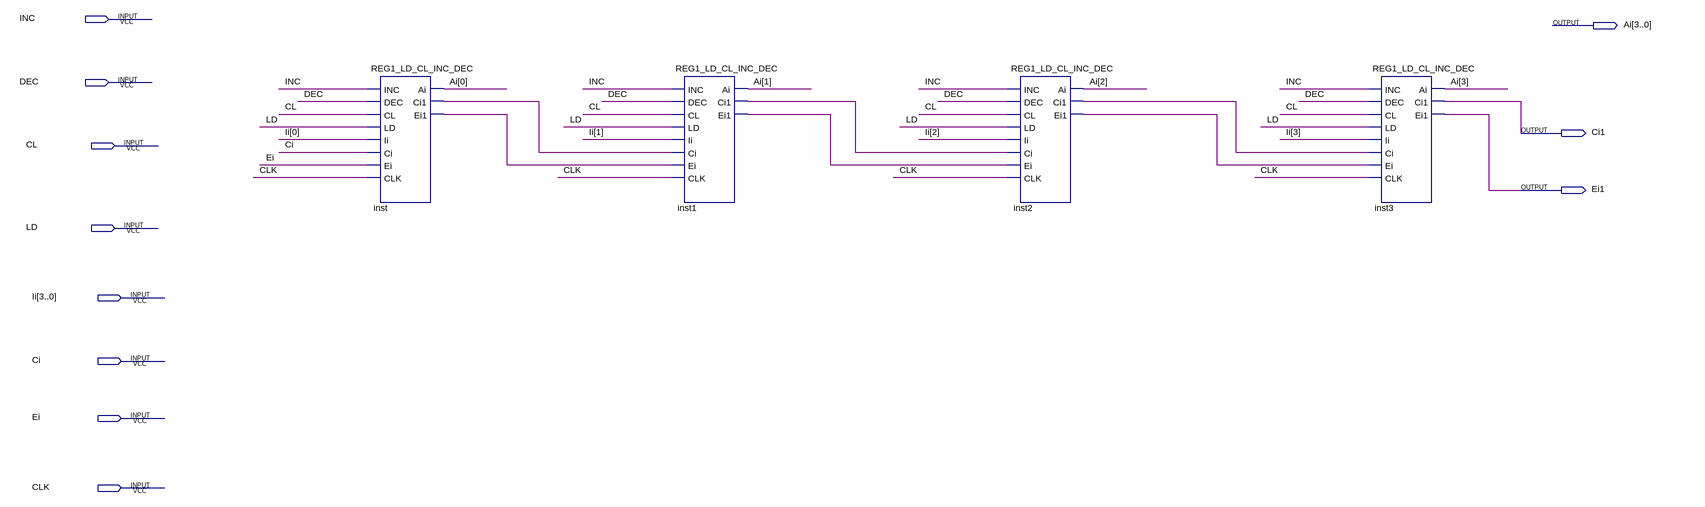
[diagram p0: schematic sheet]
// Quartus schematic REG4_LD_CL_INC_DEC.bdf as structural Verilog: 4 symbols, 11 pins
module REG4_LD_CL_INC_DEC (
  input  INC,
  input  DEC,
  input  CL,
  input  LD,
  input  [3:0] Ii,
  input  Ci,
  input  Ei,
  input  CLK,
  output [3:0] Ai,
  output Ci1,
  output Ei1
);

  wire inst1_ci1, inst1_ei1, inst2_ci1, inst2_ei1, inst_ci1, inst_ei1;

  REG1_LD_CL_INC_DEC inst (
    .INC(INC), .DEC(DEC), .CL(CL), .LD(LD), .Ii(Ii[0]), .Ci(Ci), .Ei(Ei), .CLK(CLK), .Ai(Ai[0]),
    .Ci1(inst_ci1), .Ei1(inst_ei1));
  REG1_LD_CL_INC_DEC inst1 (
    .INC(INC), .DEC(DEC), .CL(CL), .LD(LD), .Ii(Ii[1]), .Ci(inst_ci1), .Ei(inst_ei1), .CLK(CLK), .Ai(Ai[1]),
    .Ci1(inst1_ci1), .Ei1(inst1_ei1));
  REG1_LD_CL_INC_DEC inst2 (
    .INC(INC), .DEC(DEC), .CL(CL), .LD(LD), .Ii(Ii[2]), .Ci(inst1_ci1), .Ei(inst1_ei1), .CLK(CLK),
    .Ai(Ai[2]), .Ci1(inst2_ci1), .Ei1(inst2_ei1));
  REG1_LD_CL_INC_DEC inst3 (
    .INC(INC), .DEC(DEC), .CL(CL), .LD(LD), .Ii(Ii[3]), .Ci(inst2_ci1), .Ei(inst2_ei1), .CLK(CLK),
    .Ai(Ai[3]), .Ci1(Ci1), .Ei1(Ei1));
endmodule
